# Altium project PowerLight.PrjPcb
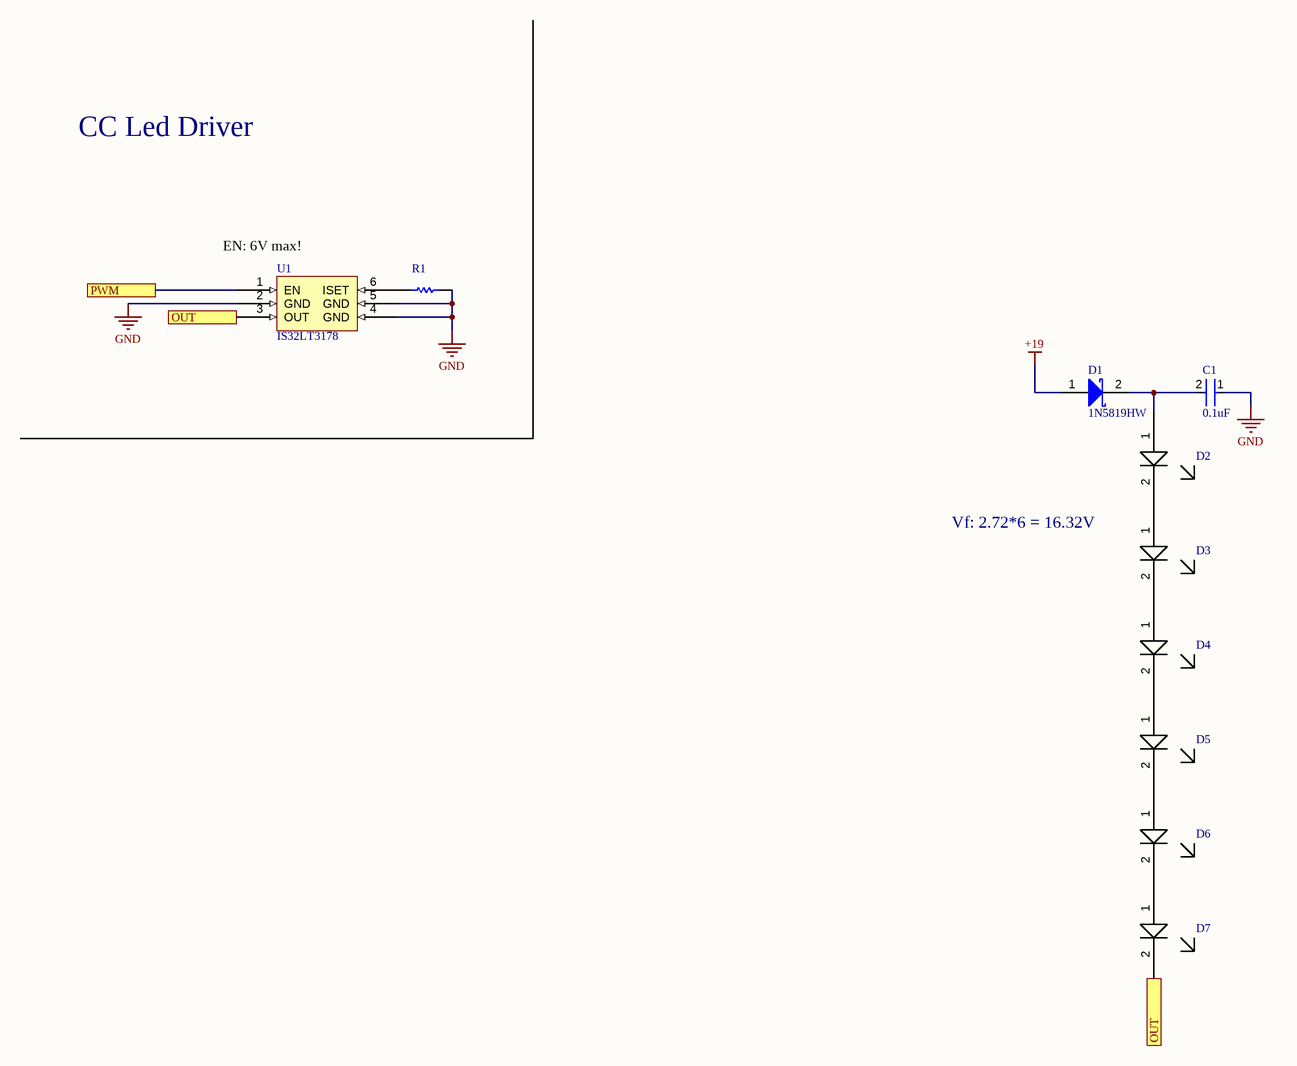
[diagram p0: Leds.SchDoc]
2 sheets, 26 parts. Net scope: flat (ports and power ports of the same name join across sheets).
Board file: PowerLightBoard.PcbDoc
Sheets:
  Leds.SchDoc
  Atmega328p-AU.SchDoc

## Sheet Leds.SchDoc
size 431 x 279 mm; SheetNumber: 1; SheetTotal: 2

### Parts
C1  0.1uF  [FP-0603-L_1_6_0_15-W_0_81-IPC_A]
D1  1N5819HW  [DIOD-SOD-123-2_V]
D2  S1W0-2835508003  [S1W0-2835508003]  (value not drawn)
D3  S1W0-2835508003  [S1W0-2835508003]  (value not drawn)
D4  S1W0-2835508003  [S1W0-2835508003]  (value not drawn)
D5  S1W0-2835508003  [S1W0-2835508003]  (value not drawn)
D6  S1W0-2835508003  [S1W0-2835508003]  (value not drawn)
D7  S1W0-2835508003  [S1W0-2835508003]  (value not drawn)
R1  (no value)  [RESC1608X55X25ML10T15]
U1  IS32LT3178  [SOT95P280X135-6N]

### Ports
OUT, PWM

### Nets
+19: D1.1(A)
GND: C1.1 R1.1 U1.2(GND) U1.4(GND) U1.5(GND)
OUT: D7.2(C) U1.3(OUT) ; port OUT
PWM: U1.1(EN) ; port PWM
NetC1_2: C1.2 D1.2(K) D2.1(A)
NetD2_2: D2.2(C) D3.1(A)
NetD3_2: D3.2(C) D4.1(A)
NetD4_2: D4.2(C) D5.1(A)
NetD5_2: D5.2(C) D6.1(A)
NetD6_2: D6.2(C) D7.1(A)
NetR1_2: R1.2 U1.6(ISET)

### Notes on the sheet
- CC Led Driver
- (near U1) EN: 6V max!
- Vf: 2.72*6 = 16.32V
- DWG. NO.
- REV.
- SHT.
- THIS DOCUMENT AND THE DATA DISCLOSED HEREIN OR HEREWITH IS THE PROPERTY OF ALTIUM LIMITED AND MAY BE FREELY DISTRIBUTED IN WHOLE. NO RIGHTS ARE RESERVED OR EXPRESS OR IMPLIED WARANTEE GIVEN.
- REVISION
- DESCRIPTION
- DATE
- APPROVED
- ENG:
- APPROVALS
- PROJECT
- DSN:
- CHK:
- REFERENCE DOCUMENTS
- PROJECT REVISION:
- TITLE
- DOCUMENT REVISION:
- DESIGN ITEM:
- BOM:
- FAB DWG:
- PCB DWG:
- ASSY DWG:
- SCALE:
- SIZE
- B
- CAGE CODE
- FILE NAME
- DWG NO.
- SHEET
- OF
- REV

### Library data of the parts
C1 = CMP-2006-04378-2: Capacitance: 1nF; Voltage: 50V; Dielectric: X7R; Tolerance: 10%; Dielectric Material: Ceramic; Case Code (Metric): 1608; Min Operating Temperature: -55°C; Weight: 7.1E-05oz; Series: -; RoHS Compliant: Yes; Radiation Hardening: No; Height: 0.9mm; Mount: Surface Mount; REACH SVHC: No SVHC; Lead Free: Lead Free; Depth: 0.81mm; Number of Pins: 2; Voltage Rating: 50V; Max Operating Temperature: 125°C; Termination: SMD/SMT; Construction: Flat; Case Code (Imperial): 0603; Width: 0.032inch; Case/Package: 0603; Contact Plating: Tin; Packaging: Tape and Reel; Voltage Rating (DC): 50V; Package Quantity: 4000; Thickness: 0.035inch; Length: 1.6mm
D1 = CMP-0303-00003-1: 1.0 A Surface Mount Schottky Barrier Rectifier, 40 V, -65 to 125 degC, 2-Pin SOD-123 Package, RoHS, Tape and Reel; PartNumber: 1N5819HW-7-F; Manufacturer: Diodes Inc; @ VR (V): 40; @ Terminal Temperature TT (degC): 90; Maximum Average Rectified Current IO (A): 1; Total Capacitance CT (pF): 50; Peak Forward Surge Current IFSM (A): 25; Forward Voltage Drop VF (V): 0.45; VR (RMS) (V): 28; RoHS: TRUE; ComponentLink2URL: http://www.diodes.com/datasheets/ds30217.pdf; PackageDescription: 2-Pin SOD-123, Body 2.7 x 1.55 mm, Pitch 3.7 mm; @ IF (A): 1; Operating and Storage Temperature Range: -65 to 125 degC; ComponentLink1Description: Manufacturer URL; ComponentLink2Description: Datasheet; ComponentLink1URL: http://www.diodes.com/; Mounting Technology: Surface Mount; DatasheetVersion: Rev. 15-2; PackageReference: SOD-123-2; Maximum Reverse Current IR (uA): 50; Peak Repetitive Reverse Voltage VRRM (V): 40; Packing: Tape and Reel
D2-D7 = S1W0-2835508003: LED, Cool 5000K 2.72V 65mA 120° 1411 (3528 Metric)
R1 = CMP-2100-03667-1: Manufacturer: Yageo; Temperature Coefficient: 200ppm/degreesC; Tolerance: 5%; Voltage Rating: 50V; Power Rating: 100mW; Resistance: 0mOhm; Width: 0.8mm; Max Operating Temperature: 155degC; Package Reference: 0603; Height: 0.45mm; Depth: 0.8mm; Package Description: 2-Pin Surface Mount Device, Body 1.6 x 0.8 mm; Termination: SMD/SMT; Package Quantity: 5000; Case/Package: 0603; Case Code (Imperial): 0603; Radiation Hardening: No; Number of Pins: 2; Length: 1.6mm; Lead Free: LeadFree; Voltage Rating (DC): 50V; Military Standard: Not; Datasheet URL: http://www.yageo.com/NewPortal/yageodocoutput?fileName=/pdf/R-Chip/PYu-RC_Group_51_RoHS_L_5.pdf; Manufacturer URL: http://www.yageo.com/; Packaging: TapeandReel; Case Code (Metric): 1608; Min Operating Temperature: -55degC; Composition: ThickFilm; RoHSCompliant: true; Contact Plating: Tin; Datasheet Version: Rev. 5, 10/2016; REACH SVHC: NoSVHC
U1 = IS32LT3178: 10 TO 150MA CONSTANT CURRENT REG

## Sheet Atmega328p-AU.SchDoc
size 431 x 279 mm; SheetNumber: 2; SheetTotal: 2
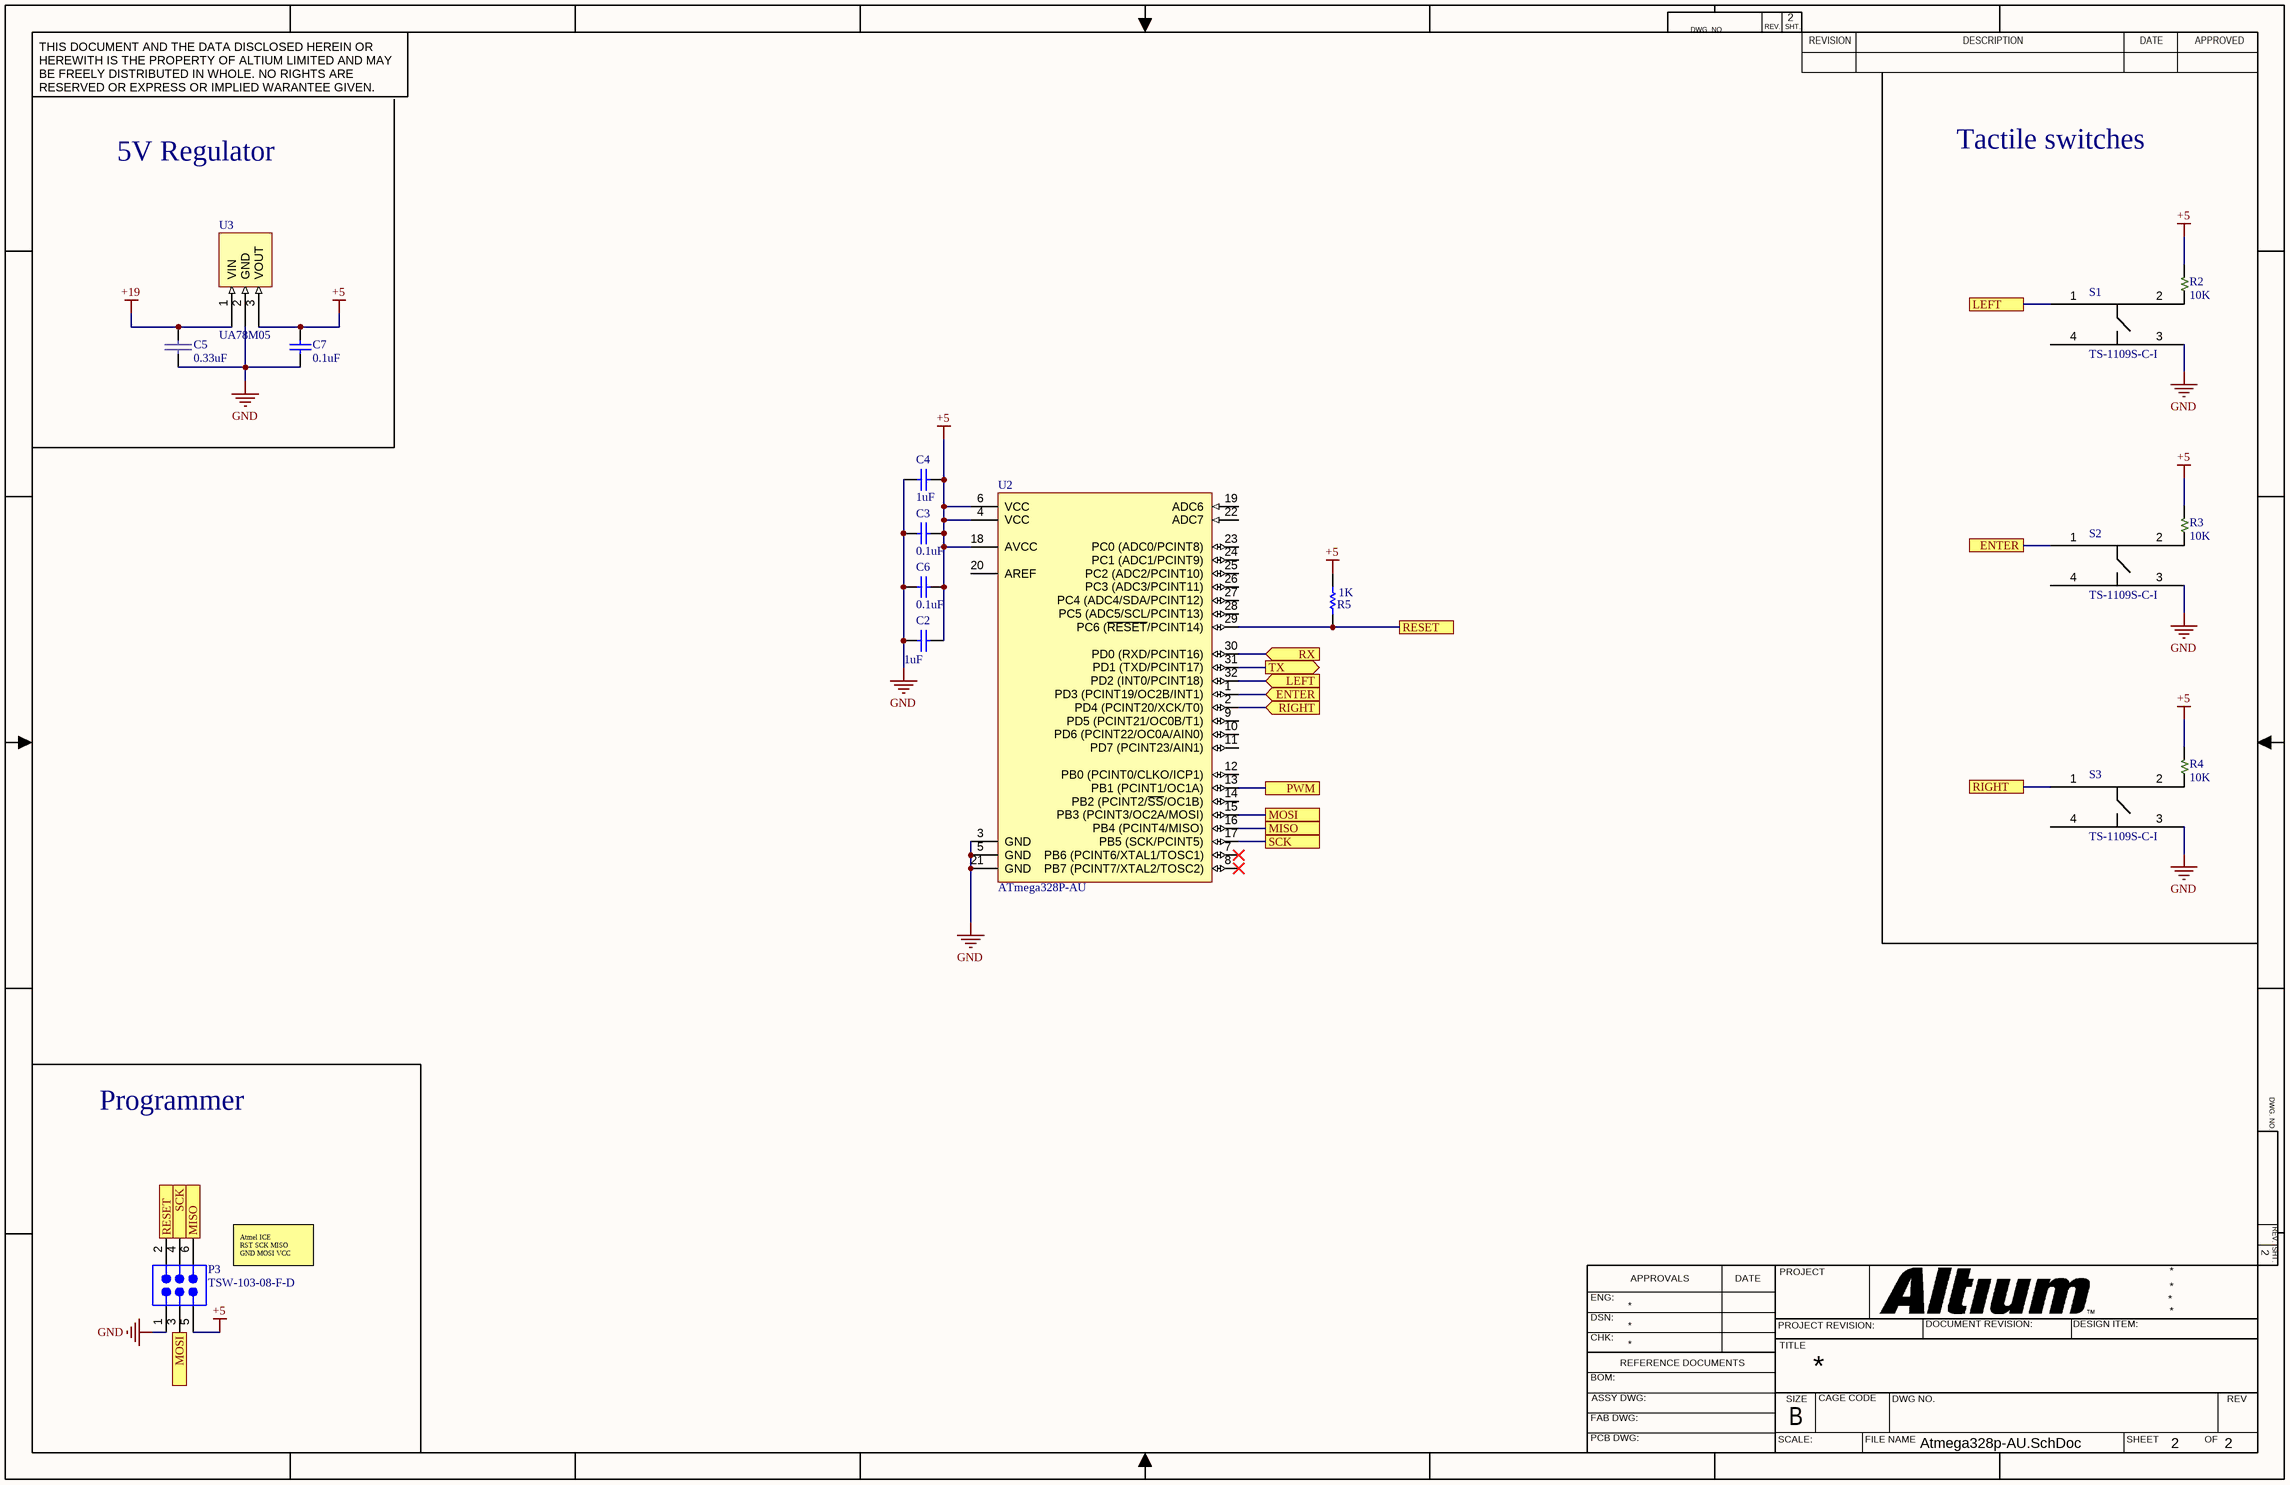
[diagram p1: Atmega328p-AU.SchDoc]

### Parts
C2  1uF  [CAPC0603(1608)100_M]
C3  0.1uF  [CAPC0603(1608)100_M]
C4  1uF  [CAPC0603(1608)100_M]
C5  0.33uF  [THT_Ceramic_Small_Cap - duplicate]
C6  0.1uF  [CAPC0603(1608)100_M]
C7  0.1uF  [CAPC0603(1608)100_M]
P3  TSW-103-08-F-D  [SMTC-TSW-103-08-X-D]
R2  10K  [0603_Resistor]
R3  10K  [0603_Resistor]
R4  10K  [0603_Resistor]
R5  1K  [RESC0603(1608)_M]
S1  TS-1109S-C-I  [TS-1109S-C-I]
S2  TS-1109S-C-I  [TS-1109S-C-I]
S3  TS-1109S-C-I  [TS-1109S-C-I]
U2  ATmega328P-AU  [32A_M]
U3  UA78M05  [UA78M05]

### Ports
ENTER, ENTER (in), LEFT, LEFT (in), MISO, MOSI, PWM, RESET, RIGHT, RIGHT (in), RX (in), SCK, TX (out)

### Nets
+5: C2.2 C3.2 C4.1 C6.2 C7.2 P3.5 R2.2 R3.2 R4.2 R5.2 U2.4(VCC) U2.6(VCC) U2.18(AVCC) U3.3(VOUT)
+19: C5.2 U3.1(VIN)
GND: C2.1 C3.1 C4.2 C5.1 C6.1 C7.1 P3.1 S1.3 S2.3 S3.3 U2.3(GND) U2.5(GND) U2.21(GND) U3.2(GND)
ENTER: S2.1 U2.1(PD3_(PCINT19/OC2B/INT1)) ; port ENTER
LEFT: S1.1 U2.32(PD2_(INT0/PCINT18)) ; port LEFT
MISO: P3.6 U2.16(PB4_(PCINT4/MISO)) ; port MISO
MOSI: P3.3 U2.15(PB3_(PCINT3/OC2A/MOSI)) ; port MOSI
PWM: U2.13(PB1_(PCINT1/OC1A)) ; port PWM
RESET: P3.2 R5.1 U2.29(PC6_(~{RESET}/PCINT14)) ; port RESET
RIGHT: S3.1 U2.2(PD4_(PCINT20/XCK/T0)) ; port RIGHT
RX: U2.30(PD0_(RXD/PCINT16)) ; port RX
SCK: P3.4 U2.17(PB5_(SCK/PCINT5)) ; port SCK
TX: U2.31(PD1_(TXD/PCINT17)) ; port TX
NetR2_1: R2.1 S1.2
NetR3_1: R3.1 S2.2
NetR4_1: R4.1 S3.2

Not connected (* = marked no-connect by the designer): S1 4; S2 4; S3 4; U2 7(PB6_(PCINT6/XTAL1/TOSC1))* 8(PB7_(PCINT7/XTAL2/TOSC2))* 9(PD5_(PCINT21/OC0B/T1)) 10(PD6_(PCINT22/OC0A/AIN0)) 11(PD7_(PCINT23/AIN1)) 12(PB0_(PCINT0/CLKO/ICP1)) 14(PB2_(PCINT2/~{SS}/OC1B)) 19(ADC6) 20(AREF) 22(ADC7) 23(PC0_(ADC0/PCINT8)) 24(PC1_(ADC1/PCINT9)) 25(PC2_(ADC2/PCINT10)) 26(PC3_(ADC3/PCINT11)) 27(PC4_(ADC4/SDA/PCINT12)) 28(PC5_(ADC5/SCL/PCINT13))

### Notes on the sheet
- 5V Regulator
- Tactile switches
- Programmer
- (near P3) Atmel ICE
  RST SCK MISO
  GND MOSI VCC
- DWG. NO.
- REV.
- SHT.
- THIS DOCUMENT AND THE DATA DISCLOSED HEREIN OR HEREWITH IS THE PROPERTY OF ALTIUM LIMITED AND MAY BE FREELY DISTRIBUTED IN WHOLE. NO RIGHTS ARE RESERVED OR EXPRESS OR IMPLIED WARANTEE GIVEN.
- REVISION
- DESCRIPTION
- DATE
- APPROVED
- ENG:
- APPROVALS
- PROJECT
- DSN:
- CHK:
- REFERENCE DOCUMENTS
- PROJECT REVISION:
- TITLE
- DOCUMENT REVISION:
- DESIGN ITEM:
- BOM:
- FAB DWG:
- PCB DWG:
- ASSY DWG:
- SCALE:
- SIZE
- B
- CAGE CODE
- FILE NAME
- DWG NO.
- SHEET
- OF
- REV

### Library data of the parts
C2-C4 C6 C7 = CMP-1035-00774-1: CAP 20pF 25V ±0.25pF 0603 (1608 Metric) Thickness 1mm SMD; Case-EIA: 0603; Tolerance: Â±0.25pF; Case-Metric: 1608; Max Thickness: 1 mm; Rated Voltage: 25 V; Technology: SMT; Value: 20pF
C5 = THT_Ceramic_Small_Cap: Through hole red disc ceramic capacitor
P3 = CMP-1024-00337-1: 0.025" SQ Post Header, Through-hole, Vertical, -55 to 125 degC, 2.54 mm Pitch, 6-Pin, Male, RoHS; Manufacturer: Samtec; Pitch: 2.54 mm; ComponentLink1URL: http://www.samtec.com; PackageReference: TSW-103-08-X-D; ComponentLink3Description: Package Specification; PackageDescription: .025[0.64] SQ. Post Terminal Strip Assembly; PartNumber: TSW-103-08-F-D; DatasheetVersion: F-214; ComponentLink1Description: Manufacturer URL; ComponentLink2Description: Datasheet; ComponentLink2URL: http://www.samtec.com/documents/webfiles/pdf/TSW_TH.PDF; PackageVersion: DM, 8/1988; Orientation: Vertical; Mounting Technology: Through-hole; RoHS: True; Temperature Range: -55 to 125 degC; ComponentLink3URL: http://www.samtec.com/documents/webfiles/cpdf/TSW-XXX-XX-XXX-X-XX-XXX-MKT.pdf
R2-R4 = 0603_Resistor: 0603 Resistor
R5 = CMP-1012-00510-1: 1K 0.1W 1% 0603 (1608 Metric)  SMD; Case-Metric: 1608; Case-EIA: 0603; Value: 1000.00 Ohm; Technology: SMT; Tolerance: 1 %; Power: 0.1 W
S1-S3 = TS-1109S-C-I: https://www.x-on.com.au/mpn/xkb/ts1109sci
U2 = CMP-0095-00269-1: 8-bit AVR Microcontroller, 32KB Flash, 1KB EEPROM, 2KB SRAM, 32-pin TQFP, Industrial Grade (-40°C to 85°C); Code_JEDEC: MS-026-ABA; PackageVersion: revB, Oct-2001; DatasheetVersion: revA, Jan-2010; PackageReference: 32A; PackageDescription: 32-Lead, 7x7x1.0 mm Body, 0.8mm Lead Pitch, Thin Profile Plastic Quad Flat Package (TQFP)

## Nets that join several sheets
+19: Leds (D1.1), Atmega328p-AU (C5.2 U3.1)
GND: Leds (5 pins), Atmega328p-AU (14 pins)
PWM: Leds (U1.1), Atmega328p-AU (U2.13)